# Altium schematic sheet Digital Input.SchDoc
size A4
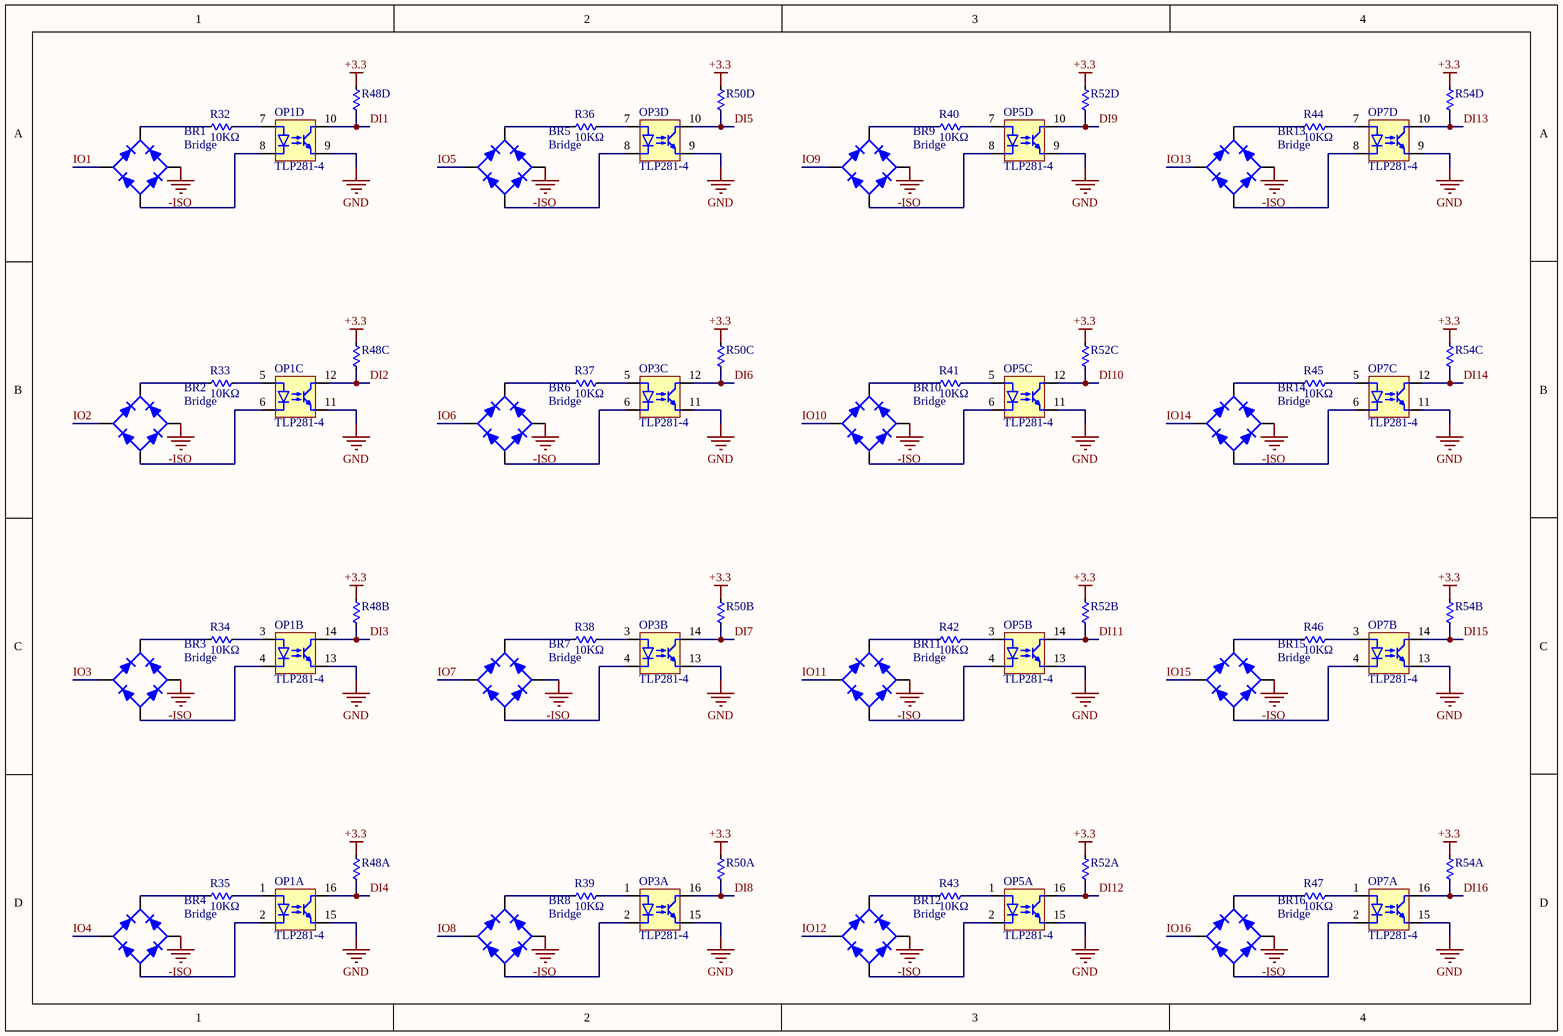
[diagram p0: Digital Input.SchDoc]

## Parts
BR1  Bridge  [SOP254P690X270-4L]
BR2  Bridge  [SOP254P690X270-4L]
BR3  Bridge  [SOP254P690X270-4L]
BR4  Bridge  [SOP254P690X270-4L]
BR5  Bridge  [SOP254P690X270-4L]
BR6  Bridge  [SOP254P690X270-4L]
BR7  Bridge  [SOP254P690X270-4L]
BR8  Bridge  [SOP254P690X270-4L]
BR9  Bridge  [SOP254P690X270-4L]
BR10  Bridge  [SOP254P690X270-4L]
BR11  Bridge  [SOP254P690X270-4L]
BR12  Bridge  [SOP254P690X270-4L]
BR13  Bridge  [SOP254P690X270-4L]
BR14  Bridge  [SOP254P690X270-4L]
BR15  Bridge  [SOP254P690X270-4L]
BR16  Bridge  [SOP254P690X270-4L]
OP1  TLP281-4  [SO16 TOSHIBA OPTOCOUPLER]  (parts A,B,C,D of 4)
OP3  TLP281-4  [SO16 TOSHIBA OPTOCOUPLER]  (parts A,B,C,D of 4)
OP5  TLP281-4  [SO16 TOSHIBA OPTOCOUPLER]  (parts A,B,C,D of 4)
OP7  TLP281-4  [SO16 TOSHIBA OPTOCOUPLER]  (parts A,B,C,D of 4)
R32  10KΩ  [RES 0603 10K]
R33  10KΩ  [RES 0603 10K]
R34  10KΩ  [RES 0603 10K]
R35  10KΩ  [RES 0603 10K]
R36  10KΩ  [RES 0603 10K]
R37  10KΩ  [RES 0603 10K]
R38  10KΩ  [RES 0603 10K]
R39  10KΩ  [RES 0603 10K]
R40  10KΩ  [RES 0603 10K]
R41  10KΩ  [RES 0603 10K]
R42  10KΩ  [RES 0603 10K]
R43  10KΩ  [RES 0603 10K]
R44  10KΩ  [RES 0603 10K]
R45  10KΩ  [RES 0603 10K]
R46  10KΩ  [RES 0603 10K]
R47  10KΩ  [RES 0603 10K]
R48  10KΩ  [RES ARRAY 4X0603 10K]  (value not drawn)  (parts A,B,C,D of 4)
R50  10KΩ  [RES ARRAY 4X0603 10K]  (value not drawn)  (parts A,B,C,D of 4)
R52  10KΩ  [RES ARRAY 4X0603 10K]  (value not drawn)  (parts A,B,C,D of 4)
R54  10KΩ  [RES ARRAY 4X0603 10K]  (value not drawn)  (parts A,B,C,D of 4)

## Nets
+3.3: R48.5 R48.6 R48.7 R48.8 R50.5 R50.6 R50.7 R50.8 R52.5 R52.6 R52.7 R52.8 R54.5 R54.6 R54.7 R54.8
-ISO: BR1.4 BR2.4 BR3.4 BR4.4 BR5.4 BR6.4 BR7.4 BR8.4 BR9.4 BR10.4 BR11.4 BR12.4 BR13.4 BR14.4 BR15.4 BR16.4
GND: OP1.9 OP1.11 OP1.13 OP1.15 OP3.9 OP3.11 OP3.13 OP3.15 OP5.9 OP5.11 OP5.13 OP5.15 OP7.9 OP7.11 OP7.13 OP7.15
DI1: OP1.10 R48.4
DI2: OP1.12 R48.3
DI3: OP1.14 R48.2
DI4: OP1.16 R48.1
DI5: OP3.10 R50.4
DI6: OP3.12 R50.3
DI7: OP3.14 R50.2
DI8: OP3.16 R50.1
DI9: OP5.10 R52.4
DI10: OP5.12 R52.3
DI11: OP5.14 R52.2
DI12: OP5.16 R52.1
DI13: OP7.10 R54.4
DI14: OP7.12 R54.3
DI15: OP7.14 R54.2
DI16: OP7.16 R54.1
IO1: BR1.3
IO2: BR2.3
IO3: BR3.3
IO4: BR4.3
IO5: BR5.3
IO6: BR6.3
IO7: BR7.3
IO8: BR8.3
IO9: BR9.3
IO10: BR10.3
IO11: BR11.3
IO12: BR12.3
IO13: BR13.3
IO14: BR14.3
IO15: BR15.3
IO16: BR16.3
NetBR1_1: BR1.1(+) R32.1
NetBR1_2: BR1.2(-) OP1.8
NetBR2_1: BR2.1(+) R33.1
NetBR2_2: BR2.2(-) OP1.6
NetBR3_1: BR3.1(+) R34.1
NetBR3_2: BR3.2(-) OP1.4
NetBR4_1: BR4.1(+) R35.1
NetBR4_2: BR4.2(-) OP1.2
NetBR5_1: BR5.1(+) R36.1
NetBR5_2: BR5.2(-) OP3.8
NetBR6_1: BR6.1(+) R37.1
NetBR6_2: BR6.2(-) OP3.6
NetBR7_1: BR7.1(+) R38.1
NetBR7_2: BR7.2(-) OP3.4
NetBR8_1: BR8.1(+) R39.1
NetBR8_2: BR8.2(-) OP3.2
NetBR9_1: BR9.1(+) R40.1
NetBR9_2: BR9.2(-) OP5.8
NetBR10_1: BR10.1(+) R41.1
NetBR10_2: BR10.2(-) OP5.6
NetBR11_1: BR11.1(+) R42.1
NetBR11_2: BR11.2(-) OP5.4
NetBR12_1: BR12.1(+) R43.1
NetBR12_2: BR12.2(-) OP5.2
NetBR13_1: BR13.1(+) R44.1
NetBR13_2: BR13.2(-) OP7.8
NetBR14_1: BR14.1(+) R45.1
NetBR14_2: BR14.2(-) OP7.6
NetBR15_1: BR15.1(+) R46.1
NetBR15_2: BR15.2(-) OP7.4
NetBR16_1: BR16.1(+) R47.1
NetBR16_2: BR16.2(-) OP7.2
NetOP1_1: OP1.1 R35.2
NetOP1_3: OP1.3 R34.2
NetOP1_5: OP1.5 R33.2
NetOP1_7: OP1.7 R32.2
NetOP3_1: OP3.1 R39.2
NetOP3_3: OP3.3 R38.2
NetOP3_5: OP3.5 R37.2
NetOP3_7: OP3.7 R36.2
NetOP5_1: OP5.1 R43.2
NetOP5_3: OP5.3 R42.2
NetOP5_5: OP5.5 R41.2
NetOP5_7: OP5.7 R40.2
NetOP7_1: OP7.1 R47.2
NetOP7_3: OP7.3 R46.2
NetOP7_5: OP7.5 R45.2
NetOP7_7: OP7.7 R44.2

## Library data of the parts
R32-R47 = RES 10K
R48 R50 R52 R54 = RES ARRAY 10K